# EAGLE design LCMeter_v1_2 (EAGLE 6.5.0)
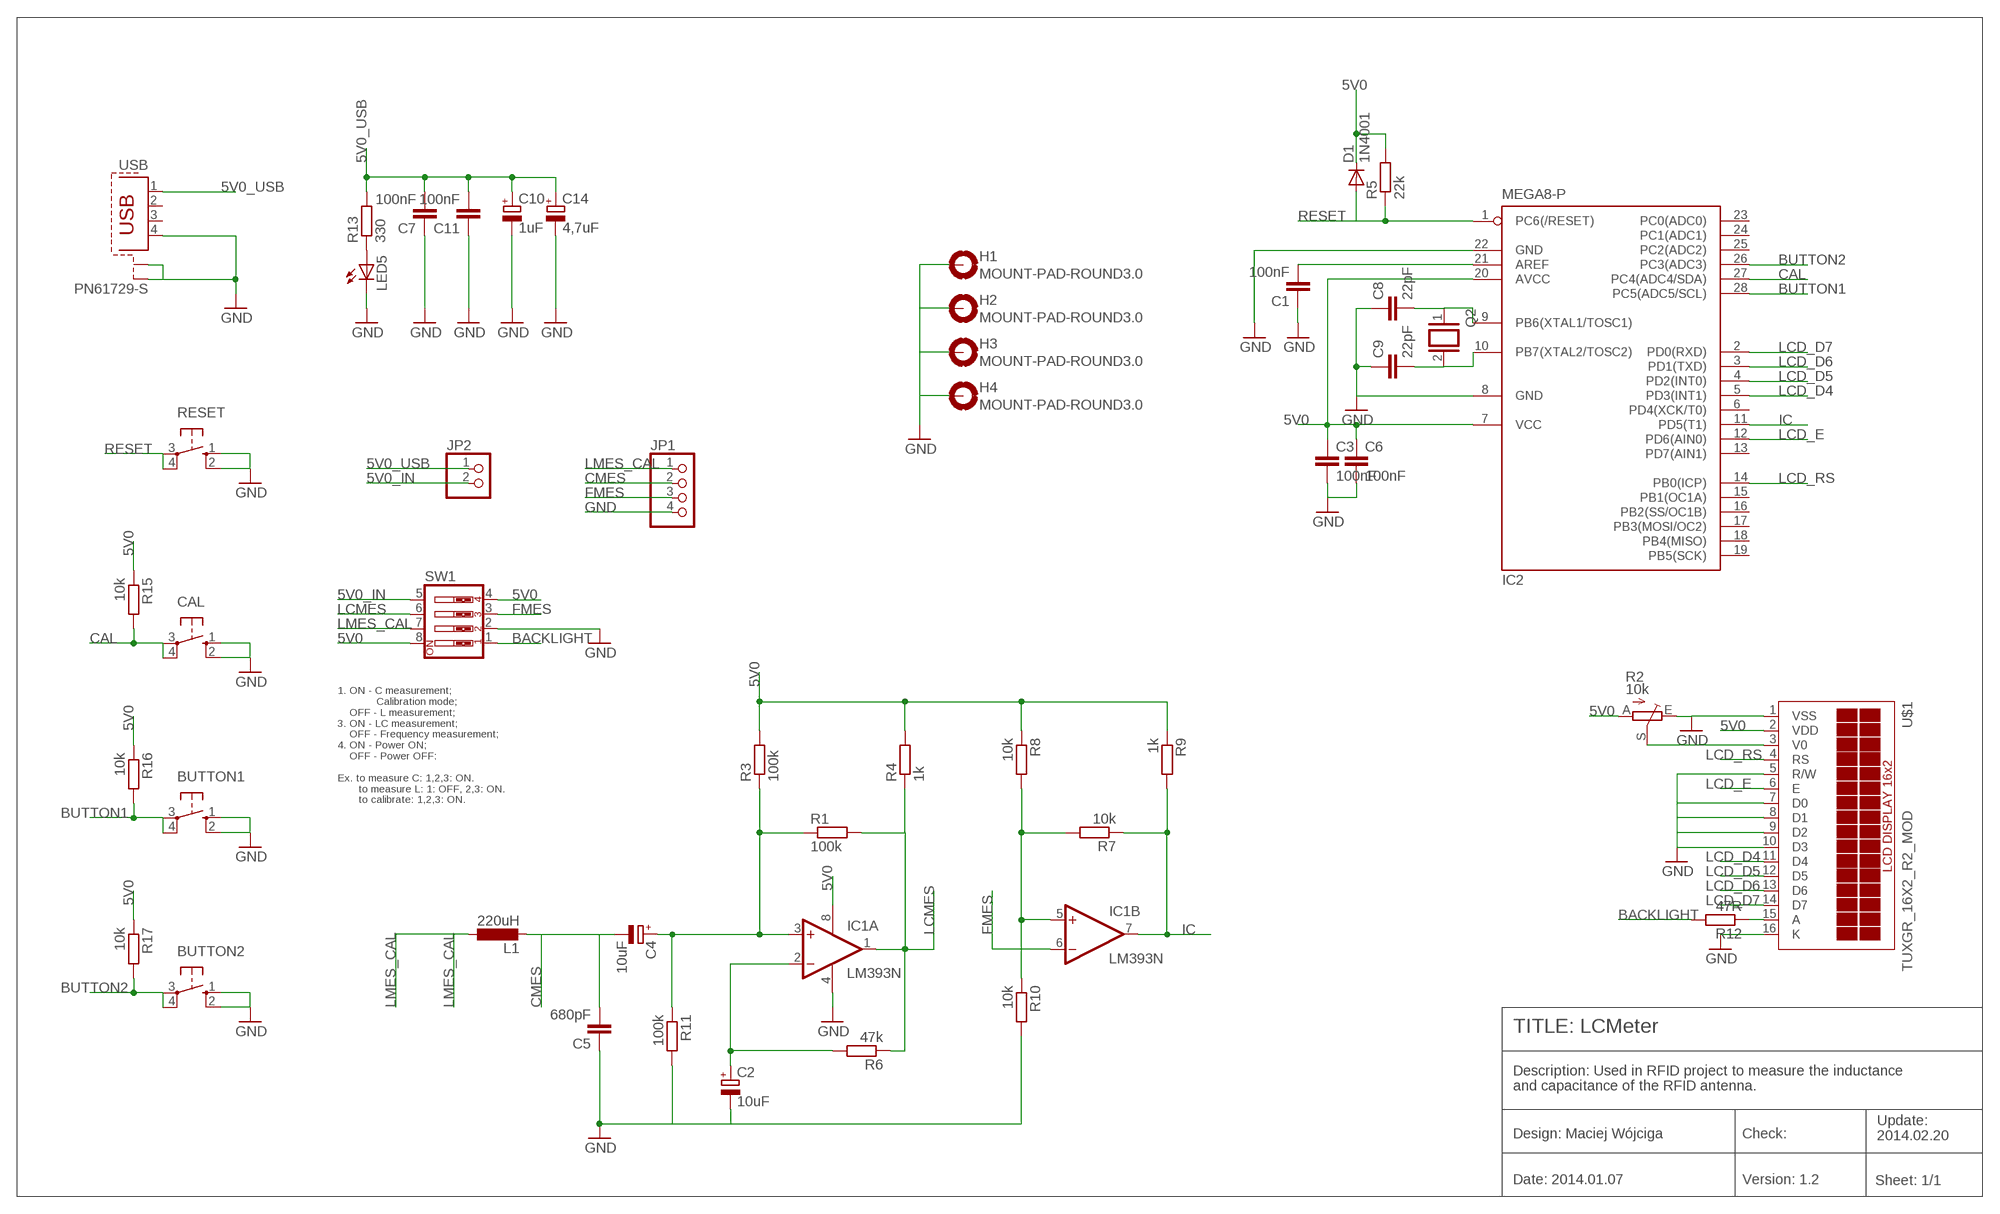
[diagram p0: schematic, sheet 1]

## Parts
BUTTON1  10-XX  [B3F-10XX]
BUTTON2  10-XX  [B3F-10XX]
C1  100nF  C-EU025-025X050  [C025-025X050]
C2  10uF  CPOL-EUE2,5-6E  [E2,5-6E]
C3  100nF  C-EU025-025X050  [C025-025X050]
C4  10uF  CPOL-EUE2,5-6E  [E2,5-6E]
C5  680pF  C-EU025-025X050  [C025-025X050]
C6  100nF  C-EU025-025X050  [C025-025X050]
C7  100nF  C-EU025-025X050  [C025-025X050]
C8  22pF  C-EU025-025X050  [C025-025X050]
C9  22pF  C-EU025-025X050  [C025-025X050]
C10  1uF  CPOL-EUE2.5-5  [E2,5-5]
C11  100nF  C-EU025-025X050  [C025-025X050]
C14  4,7uF  CPOL-EUE2.5-5  [E2,5-5]
CAL  10-XX  [B3F-10XX]
D1  1N4001  1N4004  [DO41-10]
H1  MOUNT-PAD-ROUND3.0  [3,0-PAD]
H2  MOUNT-PAD-ROUND3.0  [3,0-PAD]
H3  MOUNT-PAD-ROUND3.0  [3,0-PAD]
H4  MOUNT-PAD-ROUND3.0  [3,0-PAD]
IC1  LM393N  [DIL08]
IC2  MEGA8-P  [DIL28-3]
JP1  PINHD-1X4  [1X04]
JP2  PINHD-1X2/90  [1X02/90]
L1  220uH  L-EU6000-XXX-RC  [6000-XXXX-RC]
LED5  LED3MM  [LED3MM]
Q2  XTAL/S  [QS]
R1  100k  R-EU_0207/10  [0207/10]
R2  10k  TRIM_EU-RJ9W  [RJ9W]
R3  100k  R-EU_0207/10  [0207/10]
R4  1k  R-EU_0207/10  [0207/10]
R5  22k  R-EU_0207/10  [0207/10]
R6  47k  R-EU_0207/10  [0207/10]
R7  10k  R-EU_0207/10  [0207/10]
R8  10k  R-EU_0207/10  [0207/10]
R9  1k  R-EU_0207/10  [0207/10]
R10  10k  R-EU_0207/10  [0207/10]
R11  100k  R-EU_0207/10  [0207/10]
R12  47R  R-EU_0207/10  [0207/10]
R13  330  R-EU_0207/10  [0207/10]
R15  10k  R-EU_0207/10  [0207/10]
R16  10k  R-EU_0207/10  [0207/10]
R17  10k  R-EU_0207/10  [0207/10]
RESET  10-XX  [B3F-10XX]
SW1  SW_DIP-4  [EDG-04]
U$1  TUXGR_16X2_R2_MOD  [TUXGR_16X2_R2_MOD]
USB  PN61729-S  [PN61729-S]

## Nets
5V0: C3.1 C6.1 D1.C IC1.8(P:V+) IC2.7(VCC) IC2.20(AVCC) R2.A R3.2 R4.2 R5.2 R8.1 R9.1 R15.1 R16.1 R17.1 SW1.4 SW1.8 U$1.2(VDD)
5V0_IN: JP2.2 SW1.5
5V0_USB: C7.2 C10.+ C11.2 C14.+ JP2.1 R13.2 USB.1
BACKLIGHT: R12.2 SW1.1
BUTTON1: BUTTON1.3(P) BUTTON1.4(P1) IC2.28(PC5(ADC5/SCL)) R16.2
BUTTON2: BUTTON2.3(P) BUTTON2.4(P1) IC2.26(PC3(ADC3)) R17.2
CAL: CAL.3(P) CAL.4(P1) IC2.27(PC4(ADC4/SDA)) R15.2
CMES: C4.- C5.2 JP1.2 L1.2
FMES: IC1.6(B:-IN) JP1.3 SW1.3
GND: BUTTON1.1(S) BUTTON1.2(S1) BUTTON2.1(S) BUTTON2.2(S1) C1.1 C2.- C3.2 C5.1 C6.2 C7.1 C8.1 C9.1 C10.- C11.1 C14.- CAL.1(S) CAL.2(S1) H1.B3,0(MOUNT) H2.B3,0(MOUNT) H3.B3,0(MOUNT) H4.B3,0(MOUNT) IC1.4(P:V-) IC2.8(GND) IC2.22(GND) JP1.4 LED5.K(C) R2.E R10.2 R11.2 RESET.1(S) RESET.2(S1) SW1.2 U$1.1(VSS) U$1.5(R/W) U$1.7(D0) U$1.8(D1) U$1.9(D2) U$1.10(D3) U$1.16(K) USB.4 USB.S1 USB.S2
IC: IC1.7(B:OUT) IC2.11(PD5(T1)) R7.1 R9.2
LCD_D4: IC2.5(PD3(INT1)) U$1.11(D4)
LCD_D5: IC2.4(PD2(INT0)) U$1.12(D5)
LCD_D6: IC2.3(PD1(TXD)) U$1.13(D6)
LCD_D7: IC2.2(PD0(RXD)) U$1.14(D7)
LCD_E: IC2.12(PD6(AIN0)) U$1.6(E)
LCD_RS: IC2.14(PB0(ICP)) U$1.4(RS)
LCMES: IC1.1(A:OUT) R1.2 R4.1 R6.1 SW1.6
LMES_CAL: JP1.1 L1.1 SW1.7
N$1: C1.2 IC2.21(AREF)
N$3: C2.+ IC1.2(A:-IN) R6.2
N$4: R2.S U$1.3(V0)
N$8: C4.+ IC1.3(A:+IN) R1.1 R3.1 R11.1
N$10: LED5.A R13.1
N$11: IC1.5(B:+IN) R7.2 R8.2 R10.1
N$16: R12.1 U$1.15(A)
N$29: C8.2 IC2.9(PB6(XTAL1/TOSC1)) Q2.1
N$35: C9.2 IC2.10(PB7(XTAL2/TOSC2)) Q2.2
RESET: D1.A IC2.1(PC6(/RESET)) R5.1 RESET.3(P) RESET.4(P1)
Unconnected: IC2.6(PD4(XCK/T0)) IC2.13(PD7(AIN1)) IC2.15(PB1(OC1A)) IC2.16(PB2(SS/OC1B)) IC2.17(PB3(MOSI/OC2)) IC2.18(PB4(MISO)) IC2.19(PB5(SCK)) IC2.23(PC0(ADC0)) IC2.24(PC1(ADC1)) IC2.25(PC2(ADC2)) USB.2 USB.3

## Notes on the sheet
- 1. ON - C measurement;
               Calibration mode;
      OFF - L measurement;
  3. ON - LC measurement;
      OFF - Frequency measurement;
  4. ON - Power ON;
      OFF - Power OFF:
  
  Ex. to measure C: 1,2,3: ON.
         to measure L: 1: OFF, 2,3: ON.
         to calibrate: 1,2,3: ON.
- TITLE: LCMeter
- Description: Used in RFID project to measure the inductance
  and capacitance of the RFID antenna.
- Design: Maciej Wójciga | Check:
- Update: 
  2014.02.20
- Date: 2014.01.07 | Version: 1.2 | Sheet: 1/1

## Library data of the parts
BUTTON1 BUTTON2 CAL RESET = switch-omron:10-XX: OMRON SWITCH; MPN: B3F-1000; OC_FARNELL: 176432; OC_NEWARK: 36M3542
C1 C3 C5-C9 C11 = rcl:C-EU: CAPACITOR, European symbol
C2 C4 C10 C14 = rcl:CPOL-EU: POLARIZED CAPACITOR, European symbol
D1 = diode:1N4004: DIODE general purpose rectifier, 1 A
H1-H4 = holes:MOUNT-PAD-ROUND: MOUNTING PAD, round
IC1 = linear:LM393: COMPARATOR
IC2 = atmel:MEGA8-P: MICROCONTROLLER 8 Kbytes FLASH, 1 kbytes SRAM, 512 bytes EEPROM, USART, 4-channel 10 bit ADC, 2-channel 8 bit ADC Pin compatible with Atmega48, ATMega88, ATMega168 Source: avr.lbr; OC_FARNELL: unknown; OC_NEWARK: unknown
JP1 = pinhead:PINHD-1X4: PIN HEADER
JP2 = pinhead:PINHD-1X2: PIN HEADER
L1 = rcl:L-EU: INDUCTOR, European symbol
LED5 = led:LED: LED OSRAM: - CHIPLED LG R971, LG N971, LY N971, LG Q971, LY Q971, LO R971, LY R971 LH N974, LH R974 LS Q976, LO Q976, LY Q976 LO Q996 - Hyper CHIPLED LW Q18S LB Q993, LB Q99A, LB R99A - SideLED LS A670, LO A670, LY A670, LG A670, LP A670 LB A673, LV A673, LT A673, LW A673 LH A674 LY A675 LS A676, LA A676, LO A676, LY A676, LW A676 LS A679, LY A679, LG A679 - Hyper Micro SIDELED® LS Y876, LA Y876, LO Y876, LY Y876 LT Y87S - SmartLED LW L88C, LW L88S LB L89C, LB L89S, LG L890 LS L89K, LO L89K, LY L89K LS L896, LA L896, LO L896, LY L896 - TOPLED LS T670, LO T670, LY T670, LG T670, LP T670 LSG T670, LSP T670, LSY T670, LOP T670, LYG T670 LG T671, LOG T671, LSG T671 LB T673, LV T673, LT T673, LW T673 LH T674 LS T676, LA T676, LO T676, LY T676, LB T676, LH T676, LSB T676, LW T676 LB T67C, LV T67C, LT T67C, LS T67K, LO T67K, LY T67K, LW E67C LS E67B, LA E67B, LO E67B, LY E67B, LB E67C, LV E67C, LT E67C LW T67C LS T679, LY T679, LG T679 LS T770, LO T770, LY T770, LG T770, LP T770 LB T773, LV T773, LT T773, LW T773 LH T774 LS E675, LA E675, LY E675, LS T675 LS T776, LA T776, LO T776, LY T776, LB T776 LHGB T686 LT T68C, LB T68C - Hyper Mini TOPLED® LB M676 - Mini TOPLED Santana® LG M470 LS M47K, LO M47K, LY M47K Source: http://www.osram.convergy.de LUXEON: - LUMILED® LXK2-PW12-R00, LXK2-PW12-S00, LXK2-PW14-U00, LXK2-PW14-V00 LXK2-PM12-R00, LXK2-PM12-S00, LXK2-PM14-U00 LXK2-PE12-Q00, LXK2-PE12-R00, LXK2-PE12-S00, LXK2-PE14-T00, LXK2-PE14-U00 LXK2-PB12-K00, LXK2-PB12-L00, LXK2-PB12-M00, LXK2-PB14-N00, LXK2-PB14-P00, LXK2-PB14-Q00 LXK2-PR12-L00, LXK2-PR12-M00, LXK2-PR14-Q00, LXK2-PR14-R00 LXK2-PD12-Q00, LXK2-PD12-R00, LXK2-PD12-S00 LXK2-PH12-R00, LXK2-PH12-S00 LXK2-PL12-P00, LXK2-PL12-Q00, LXK2-PL12-R00 Source: www.luxeon.com KINGBRIGHT: KA-3528ASYC Source: www.kingbright.com
Q2 = special:XTAL/S: CRYSTAL
R1 R3-R13 R15-R17 = rcl:R-EU_: RESISTOR, European symbol
R2 = pot:TRIM_EU-: POTENTIOMETER
SW1 = special:SW_DIP-4: DIP SWITCH
U$1 = display-lcd:TUXGR_16X2_R2_MOD
USB = con-berg:PN61729-S: BERG USB connector; OC_FARNELL: unknown; OC_NEWARK: unknown

## Net classes
0 default: width 0.203 mm

## Board
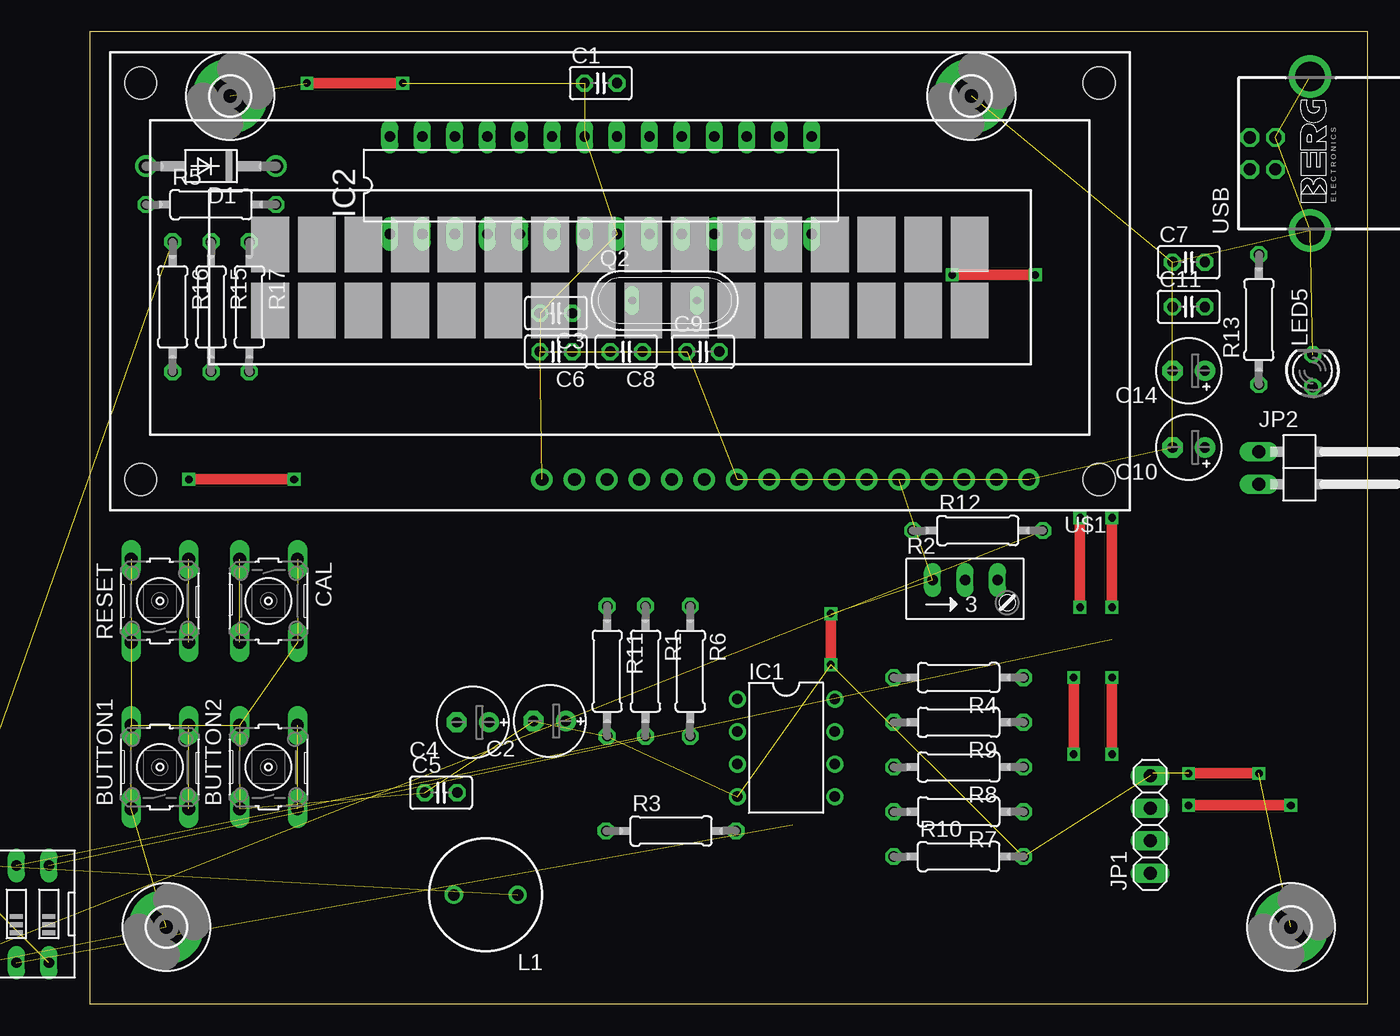
[diagram p1: board, top side]
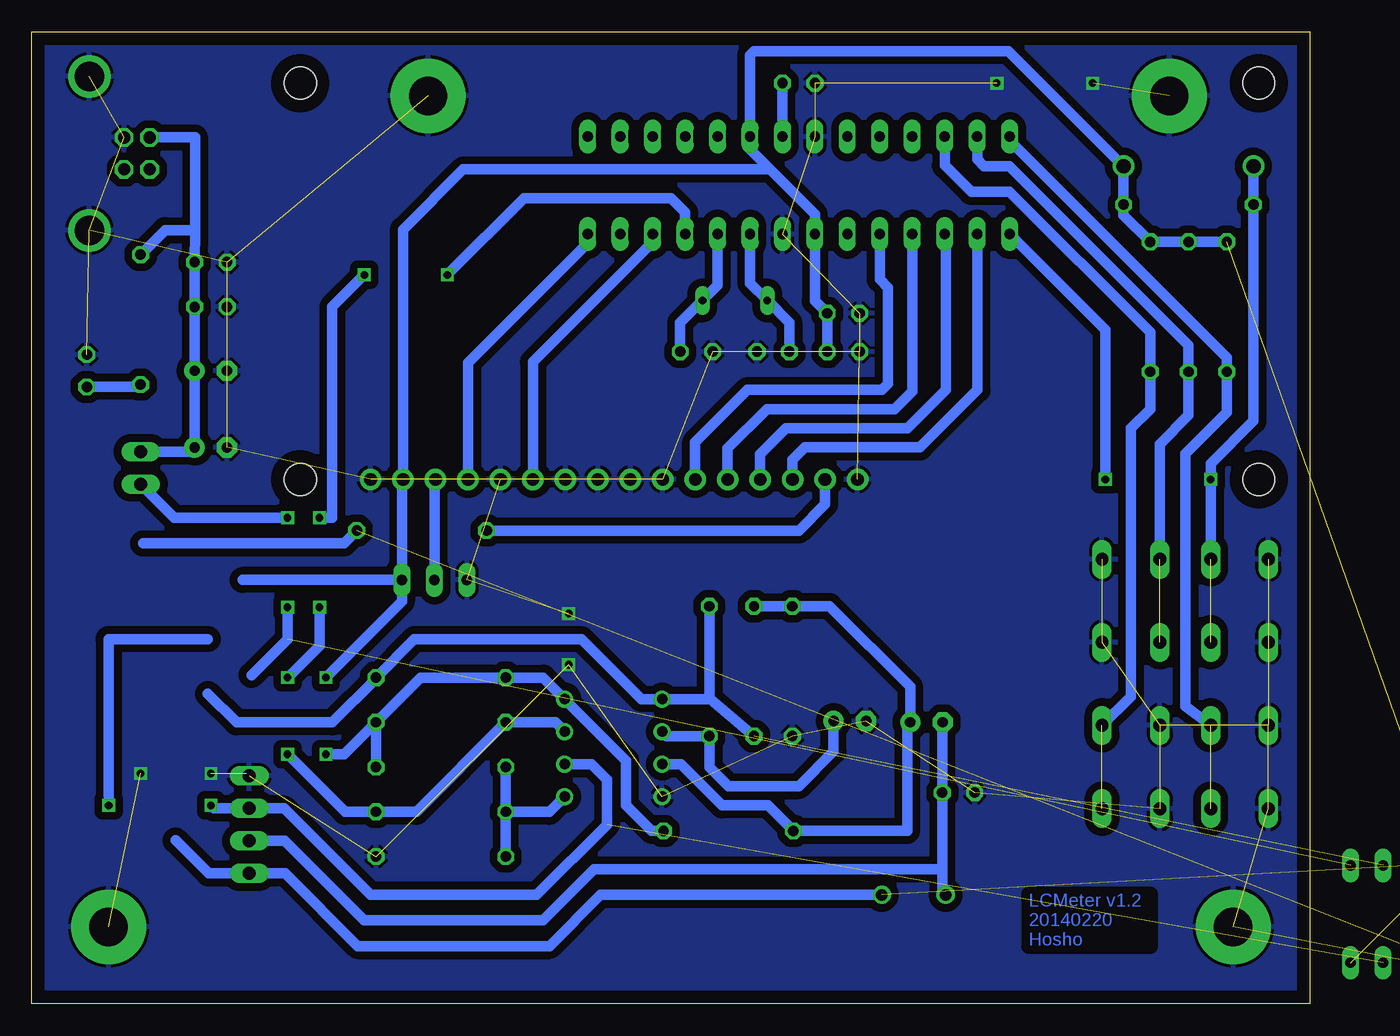
[diagram p2: board, bottom side, seen from below]

Size 100 x 76 mm. Coordinates in mm from the lower left corner, seen from the top.
Outline: 0,0 100,0 100,76 0,76 0,0
Copper layers (1*16): Top 0.035mm / dielectric 1.5mm / Bottom 0.035mm
Design rules "default": minimum track width 10mil, minimum drill 24mil, track to track 8mil, track to pad 8mil, pad to pad 8mil, via to via 8mil, smd to smd 8mil, copper to edge 40mil, drill to drill 8mil, minimum pad ring 10mil, minimum via ring 8mil, stop-mask expansion 4mil, vias tented up to drill 0mil, thermal gap 10mil

### Footprints (pad centres in the part's own frame; a part is rotated, then mirrored left to right if it is on the bottom)
B3F-10XX = drill 1.016 long: 1 -3.251,2.261; 2 3.251,2.261; 3 -3.251,-2.261; 4 3.251,-2.261
C025-025X050 = drill 0.813 octagon: 1 -1.27,0; 2 1.27,0
E2,5-6E = drill 0.813 pad 1.575: + -1.27,0 | drill 0.813 pad 1.575 octagon: - 1.27,0
E2,5-5 = drill 0.813 pad 1.6: + -1.27,0 | drill 0.813 pad 1.6 octagon: - 1.27,0
DO41-10 = drill 1.118: A 5.08,0; C -5.08,0
3,0-PAD = drill 3 pad 5.842: B3,0 0,0
DIL08 = drill 0.813 pad 1.27: 1 -3.81,-3.81; 2 -1.27,-3.81; 3 1.27,-3.81; 4 3.81,-3.81; 5 3.81,3.81; 6 1.27,3.81; 7 -1.27,3.81; 8 -3.81,3.81
DIL28-3 = drill 0.813 long: 1 -16.51,-3.81; 2 -13.97,-3.81; 3 -11.43,-3.81; 4 -8.89,-3.81; 5 -6.35,-3.81; 6 -3.81,-3.81; 7 -1.27,-3.81; 8 1.27,-3.81; 9 3.81,-3.81; 10 6.35,-3.81; 11 8.89,-3.81; 12 11.43,-3.81; 13 13.97,-3.81; 14 16.51,-3.81; 15 16.51,3.81; 16 13.97,3.81; 17 11.43,3.81; 18 8.89,3.81; 19 6.35,3.81; 20 3.81,3.81; 21 1.27,3.81; 22 -1.27,3.81; 23 -3.81,3.81; 24 -6.35,3.81; 25 -8.89,3.81; 26 -11.43,3.81; 27 -13.97,3.81; 28 -16.51,3.81
1X04 = drill 1.016 long: 1 -3.81,0; 2 -1.27,0; 3 1.27,0; 4 3.81,0
1X02/90 = drill 1.016 long: 1 -1.27,-3.81; 2 1.27,-3.81
6000-XXXX-RC = drill 0.9 pad 1.422: 1 -2.5,0; 2 2.5,0
LED3MM = drill 0.813 octagon: A -1.27,0; K 1.27,0
QS = drill 0.61 long: 1 -2.54,0; 2 2.54,0
0207/10 = drill 0.813 octagon: 1 -5.08,0; 2 5.08,0
RJ9W = drill 0.813 long: A 2.54,0.635; E -2.54,0.635; S 0,0.635
EDG-04 = drill 0.813 long: 1 -3.81,-3.81; 2 -1.27,-3.81; 3 1.27,-3.81; 4 3.81,-3.81; 5 3.81,3.81; 6 1.27,3.81; 7 -1.27,3.81; 8 -3.81,3.81
TUXGR_16X2_R2_MOD = drill 1 pad 1.676: 1 -32,15.5; 2 -29.46,15.5; 3 -26.92,15.5; 4 -24.38,15.5; 5 -21.84,15.5; 6 -19.3,15.5; 7 -16.76,15.5; 8 -14.22,15.5; 9 -11.68,15.5; 10 -9.14,15.5; 11 -6.6,15.5; 12 -4.06,15.5; 13 -1.52,15.5; 14 1.02,15.5; 15 3.56,15.5; 16 6.1,15.5 | hole 2.5: -37.5,-15.5; 37.5,-15.5; -37.5,15.5; 37.5,15.5
PN61729-S = drill 0.95 octagon: 1 1.25,4.71; 2 -1.25,4.71; 3 -1.25,2.71; 4 1.25,2.71 | drill 2.3 pad 2.9: S1 -6.02,0; S2 6.02,0

### Placement (x,y rotation side)
BUTTON1  5.5,18.5 90 top
BUTTON2  14,18.5 90 top
C1  40,72 0 top
C2  36,22.1 180 top
C3  36.5,54 180 top
C4  30,22 180 top
C5  27.5,16.5 0 top
C6  36.5,51 180 top
C7  86,58 0 top
C8  42,51 180 top
C9  48,51 0 top
C10  86,43.5 180 top
C11  86,54.5 0 top
C14  86,49.5 180 top
CAL  14,31.5 270 top
D1  9.5,65.5 180 top
H1  6,6 0 top
H2  94,6 0 top
H3  69,71 0 top
H4  11,71 0 top
IC1  54.5,20 270 top
IC2  40,64 0 top
JP1  83,14 90 top
JP2  95.3,41.9 270 top
L1  31,8.5 180 top
LED5  95.7,49.5 90 top
Q2  45,55 0 top
R1  43.5,26 270 top
R2  68.5,32.5 0 top
R3  45.5,13.5 0 top
R4  68,25.5 180 top
R5  9.5,62.5 0 top
R6  47,26 270 top
R7  68,15 180 top
R8  68,18.5 180 top
R9  68,22 180 top
R10  68,11.5 0 top
R11  40.5,26 270 top
R12  69.5,37 0 top
R13  91.5,53.5 90 top
R15  9.5,54.5 270 top
R16  6.5,54.5 270 top
R17  12.5,54.5 270 top
RESET  5.5,31.5 90 top
SW1  -7,7 0 top  (outside the outline)
U$1  41.5,56.5 180 top
USB  95.5,66.5 90 top

### Tracks (layer width: path | path; a pad name or v marks a point on that pad's centre or on a via)
5V0  (via drill 0.6)  (2 unrouted)
  Top 0.813: v77,25.5 v77,19.5
  Bottom 0.813: C6.1 C3.1 38.73,54.96 IC2.7 38.73,61.73 42.25,65.25 | 42.25,65.25 43.81,66.81 IC2.20 43.81,74.19 43.5,74.5 23.58,74.5 D1.C R5.2 14.58,61.66 R17.1 R15.1 R16.1 | R9.1 69.58,25.5 R4.2 60,25.5 IC1.8 53.5,19 53.5,15.5 51.5,13.5 R3.2 | R2.A 83.52,33.13 | R2.A 71.04,40.92 U$1.2 70.96,60.54 66.25,65.25 42.25,65.25 | R2.A 71.04,31.46 v77,25.5 | v77,19.5 75.58,19.5 R9.1 | R8.1 R9.1
5V0_IN  (via drill 0.6)  (1 unrouted)
  Top 0.813: v80,38 v80,31
  Bottom 0.813: JP2.2 88.86,38 v80,38 | v80,31 80,28.5 82.81,25.69
5V0_USB
  Bottom 0.813: USB.1 87.23,67.75 87.23,60.5 | 87.23,60.5 C7.2 C11.2 C14.+ C10.+ 87.27,43.17 JP2.1 | R13.2 89.58,60.5 87.23,60.5
BACKLIGHT  (1 unrouted)
  Bottom 0.813: 91.31,36 75.58,36 R12.2
BUTTON1  (1 unrouted)
  Bottom 0.813: BUTTON1.4 9.75,23.24 9.75,43 6.5,46.25 R16.2 6.5,50.5 23.49,67.49 IC2.28
BUTTON2  (1 unrouted)
  Bottom 0.813: BUTTON2.4 14,24.01 14,45 12.5,46.5 R17.2 12.5,52.5 23.5,63.5 26.5,63.5 28.57,65.57 IC2.26
CAL  (1 unrouted)
  Bottom 0.813: CAL.3 11.74,43.76 9.5,46 R15.2 9.5,51.5 23.5,65.5 25.5,65.5 26.03,66.03 IC2.27
CMES
  Bottom 0.813: JP1.2 80.23,12.73 74,6.5 60,6.5 56,10.5 28.77,10.5 | L1.2 28.77,8.77 28.77,10.5 | 28.77,10.5 C5.2 28.77,22 C4.-
FMES  (via drill 0.6)  (1 unrouted)
  Top 0.813: v94,15.5 v86,15.5
  Bottom 0.813: IC1.6 56.23,18.73 55,17.5 55,14 60.5,8.5 73.5,8.5 80.27,15.27 JP1.3 85.77,15.27 v86,15.5 | 86.23,28.5 94,28.5 v94,15.5
GND  (via drill 0.6)  (44 unrouted)
  Top 0.813: v86,18 v91.5,18 | v58,30.5 v58,26.5 | v17,72 v24.5,72
  Bottom 0.813: JP1.4 83.19,18
  pour Bottom (isolate 0.61): 0,76 100,76 100,0 0,0
IC  (via drill 0.6)
  Top 0.813: v67.5,57 v74,57 | v77.5,38 v77.5,31 | v80,25.5 v80,19.5
  Bottom 0.813: IC1.7 59.04,22 R9.2 69.92,15 R7.1 75.5,15 v80,19.5 | IC2.11 48.89,61.89 50,63 61.5,63 v67.5,57 | v74,57 76.5,54.5 76.5,38 v77.5,38 | v77.5,31 77.5,28 v80,25.5
LCD_D4
  Bottom 0.813: U$1.11 48.1,43.9 44,48 33.5,48 33,48.5 33,56 33.65,56.65 IC2.5
LCD_D5
  Bottom 0.813: U$1.12 45.56,43.44 42.5,46.5 32.5,46.5 31.11,47.89 IC2.4
LCD_D6
  Bottom 0.813: U$1.13 43.02,42.98 41,45 31.5,45 28.5,48 28.5,60.12 IC2.3
LCD_D7
  Bottom 0.813: U$1.14 40.48,42.52 39.5,43.5 30.5,43.5 26,48 26,60.16 IC2.2
LCD_E
  Bottom 0.813: IC2.12 51.43,59.57 60.8,50.2 U$1.6
LCD_RS
  Bottom 0.813: IC2.14 56.51,59.49 65.88,50.12 U$1.4
LCMES  (1 unrouted)
  Bottom 0.813: 47,23.81 IC1.1 52.31,23.81 57,28.5 70.08,28.5 R4.1 73.08,25.42 76.5,22 84,22 86.23,24.23 | 47,23.81 46.89,23.81 R1.2 | R6.1 47,23.81
LMES_CAL  (1 unrouted)
  Bottom 0.813: L1.1 55.5,8.5 59.5,4.5 74.5,4.5 80.19,10.19 JP1.1 86.19,10.19 88.77,12.77
N$1
  Bottom 0.813: IC2.21 C1.2
N$3
  Bottom 0.813: IC1.2 50.34,20.92 R6.2 47,18.5 45.5,17 40,17 37.27,19.73 C2.+
N$4
  Bottom 0.813: U$1.3 68.5,40.92 R2.S
N$8
  Bottom 0.813: R1.1 R11.1 37.58,31.08 31.27,24.77 C4.+ 31.5,22 31.5,13.5 R3.1 42.42,15.5 46,15.5 49.23,18.73 IC1.3
N$10
  Bottom 0.813: R13.1 91.5,48.23 LED5.A
N$11
  Bottom 0.813: R8.2 R7.2 | R7.2 R10.1 | IC1.5 59.5,15 R7.2
N$16
  Bottom 0.813: U$1.15 37.94,39.06 40,37 R12.1
N$29
  Bottom 0.813: IC2.9 43.81,56.35 Q2.1 40.73,53.27 C8.2
N$35
  Bottom 0.813: IC2.10 46.35,56.19 Q2.2 49.27,53.27 C9.2
RESET  (via drill 0.6)  (1 unrouted)
  Top 0.813: v16,41 v7.76,41
  Bottom 0.813: D1.A R5.1 4.42,45.58 7.76,42.24 v7.76,41 RESET.4 | IC2.1 16,52.7 v16,41

### Text on the board
Bottom: LCMeter v1.2 / 20140220 / Hosho